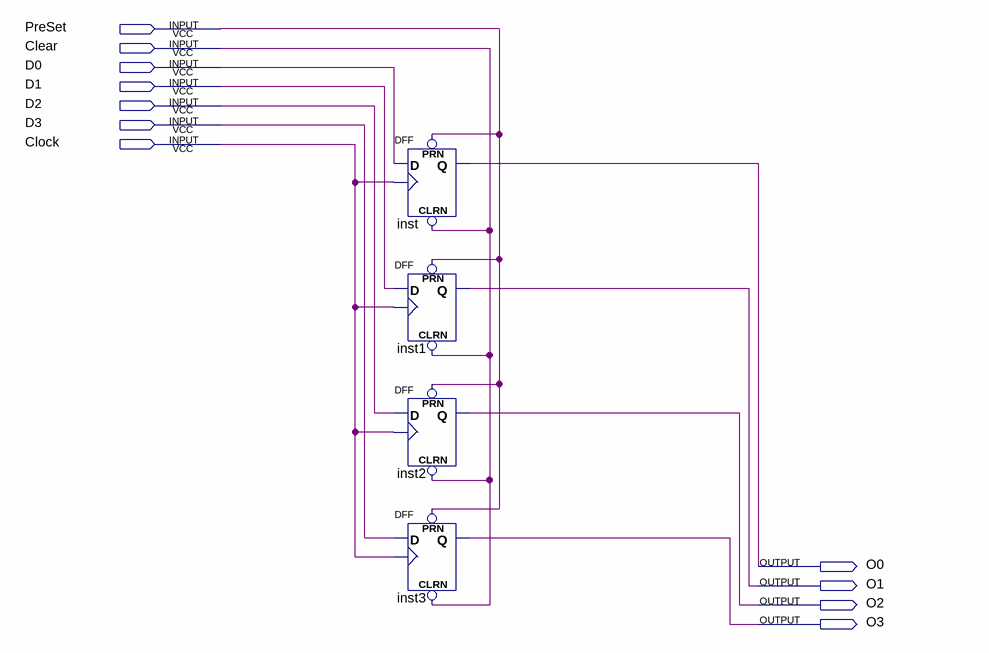
[diagram p0: schematic sheet]
// Quartus schematic 4dff.bdf as structural Verilog: 4 symbols, 11 pins
module \4dff  (
  input  PreSet,
  input  Clear,
  input  D0,
  input  D1,
  input  D2,
  input  D3,
  input  Clock,
  output O0,
  output O1,
  output O2,
  output O3
);

  DFF inst (.CLRN(Clear), .CLK(Clock), .D(D0), .PRN(PreSet), .Q(O0));
  DFF inst1 (.CLRN(Clear), .CLK(Clock), .D(D1), .PRN(PreSet), .Q(O1));
  DFF inst2 (.CLRN(Clear), .CLK(Clock), .D(D2), .PRN(PreSet), .Q(O2));
  DFF inst3 (.CLRN(Clear), .CLK(Clock), .D(D3), .PRN(PreSet), .Q(O3));
endmodule
